# Altium project streetbot_motor_controller_module.PrjPcb
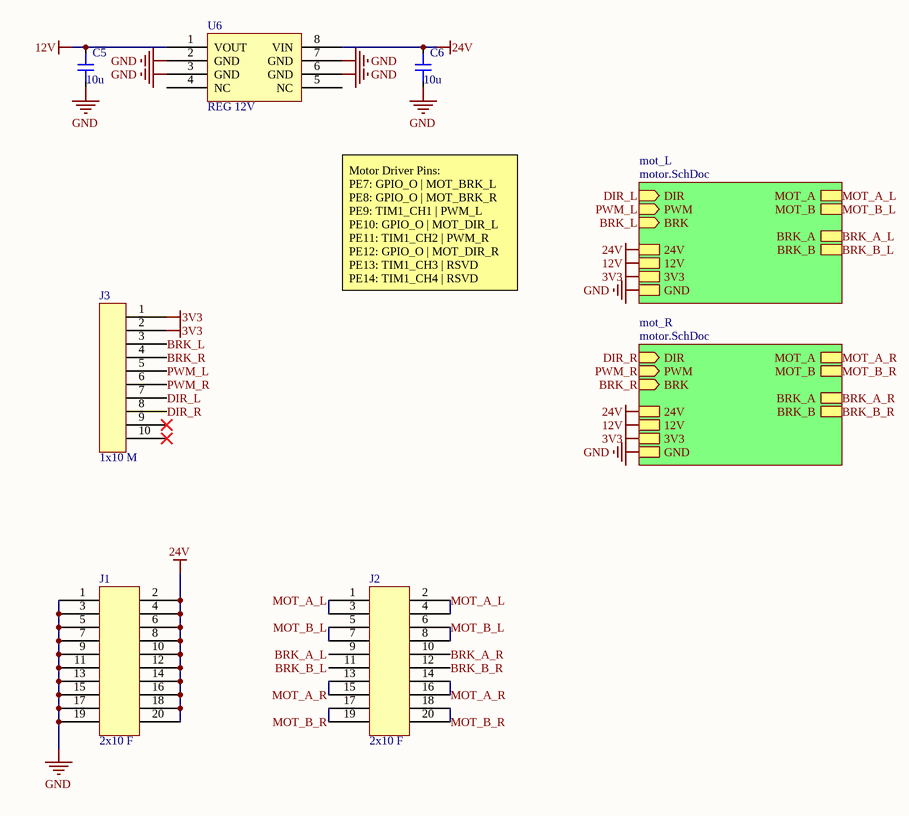
[diagram p0: main.SchDoc]
3 sheets, 60 parts. Net scope: strictly hierarchical (ports join the sheet entries above them; power ports are local).
Board file: main.PcbDoc
Sheets:
  main.SchDoc
    mot_L = motor.SchDoc
      hb1 = halfBridge.SchDoc
      hb2 = halfBridge.SchDoc
    mot_R = motor.SchDoc
      hb1 = halfBridge.SchDoc
      hb2 = halfBridge.SchDoc

## Sheet main.SchDoc
size A

### Parts
C5  10u  [CAP 0805 L]
C6  10u  [CAP 0805 L]
J1  2x10 F  [CONN HDR 2x10 F BOT]
J2  2x10 F  [CONN HDR 2x10 F BOT]
J3  1x10 M  [CONN HDR 1x10 M]
U6  REG 12V  [SOIC-8]

### Sub-sheets
mot_L = motor.SchDoc: DIR (in), PWM (in), 3V3, GND, MOT_A, MOT_B, BRK_A, BRK_B, BRK (in), 12V, 24V
mot_R = motor.SchDoc: DIR (in), PWM (in), 3V3, GND, MOT_A, MOT_B, BRK_A, BRK_B, BRK (in), 12V, 24V

### Nets
3V3: J3.1 J3.2 ; sheet mot_L/3V3, sheet mot_R/3V3
12V: C5.2 U6.1(VOUT) ; sheet mot_L/12V, sheet mot_R/12V
24V: C6.2 J1.2 J1.4 J1.6 J1.8 J1.10 J1.12 J1.14 J1.16 J1.18 J1.20 J2.9 J2.10 U6.8(VIN) ; sheet mot_L/BRK_A, sheet mot_L/24V, sheet mot_R/BRK_A, sheet mot_R/24V  [also labelled BRK_A_L, BRK_A_R]
GND: C5.1 C6.1 J1.1 J1.3 J1.5 J1.7 J1.9 J1.11 J1.13 J1.15 J1.17 J1.19 U6.2(GND) U6.3(GND) U6.6(GND) U6.7(GND) ; sheet mot_L/GND, sheet mot_R/GND
BRK_B_L: J2.11 ; sheet mot_L/BRK_B
BRK_B_R: J2.12 ; sheet mot_R/BRK_B
BRK_L: J3.3 ; sheet mot_L/BRK
BRK_R: J3.4 ; sheet mot_R/BRK
DIR_L: J3.7 ; sheet mot_L/DIR
DIR_R: J3.8 ; sheet mot_R/DIR
MOT_A_L: J2.1 J2.2 J2.3 J2.4 ; sheet mot_L/MOT_A
MOT_A_R: J2.13 J2.14 J2.15 J2.16 ; sheet mot_R/MOT_A
MOT_B_L: J2.5 J2.6 J2.7 J2.8 ; sheet mot_L/MOT_B
MOT_B_R: J2.17 J2.18 J2.19 J2.20 ; sheet mot_R/MOT_B
PWM_L: J3.5 ; sheet mot_L/PWM
PWM_R: J3.6 ; sheet mot_R/PWM

Not connected (* = marked no-connect by the designer): J3 9* 10*; U6 4(NC) 5(NC)

### Notes on the sheet
- Motor Driver Pins:
  PE7: GPIO_O | MOT_BRK_L
  PE8: GPIO_O | MOT_BRK_R
  PE9: TIM1_CH1 | PWM_L
  PE10: GPIO_O | MOT_DIR_L
  PE11: TIM1_CH2 | PWM_R
  PE12: GPIO_O | MOT_DIR_R
  PE13: TIM1_CH3 | RSVD
  PE14: TIM1_CH4 | RSVD

### Library data of the parts
C5 C6 = CAP 0805
J1 J2 = CONN Header 2x10 F: SFH11-PBPC-D10-ST-BK; Supplier 1: Digi-Key; Supplier Part Number 1: S9197-ND
J3 = CONN header 1x10 M
U6 = IC REG 12V LINEAR: L78L12ABD-TR; Supplier 1: Digi-Key; Supplier Part Number 1: 497-7767-1-ND

## Sheet motor.SchDoc
size A
Used 2 times, as channels mot_L, mot_R. Parts and nets are listed once, with the designators drawn on the sheet.
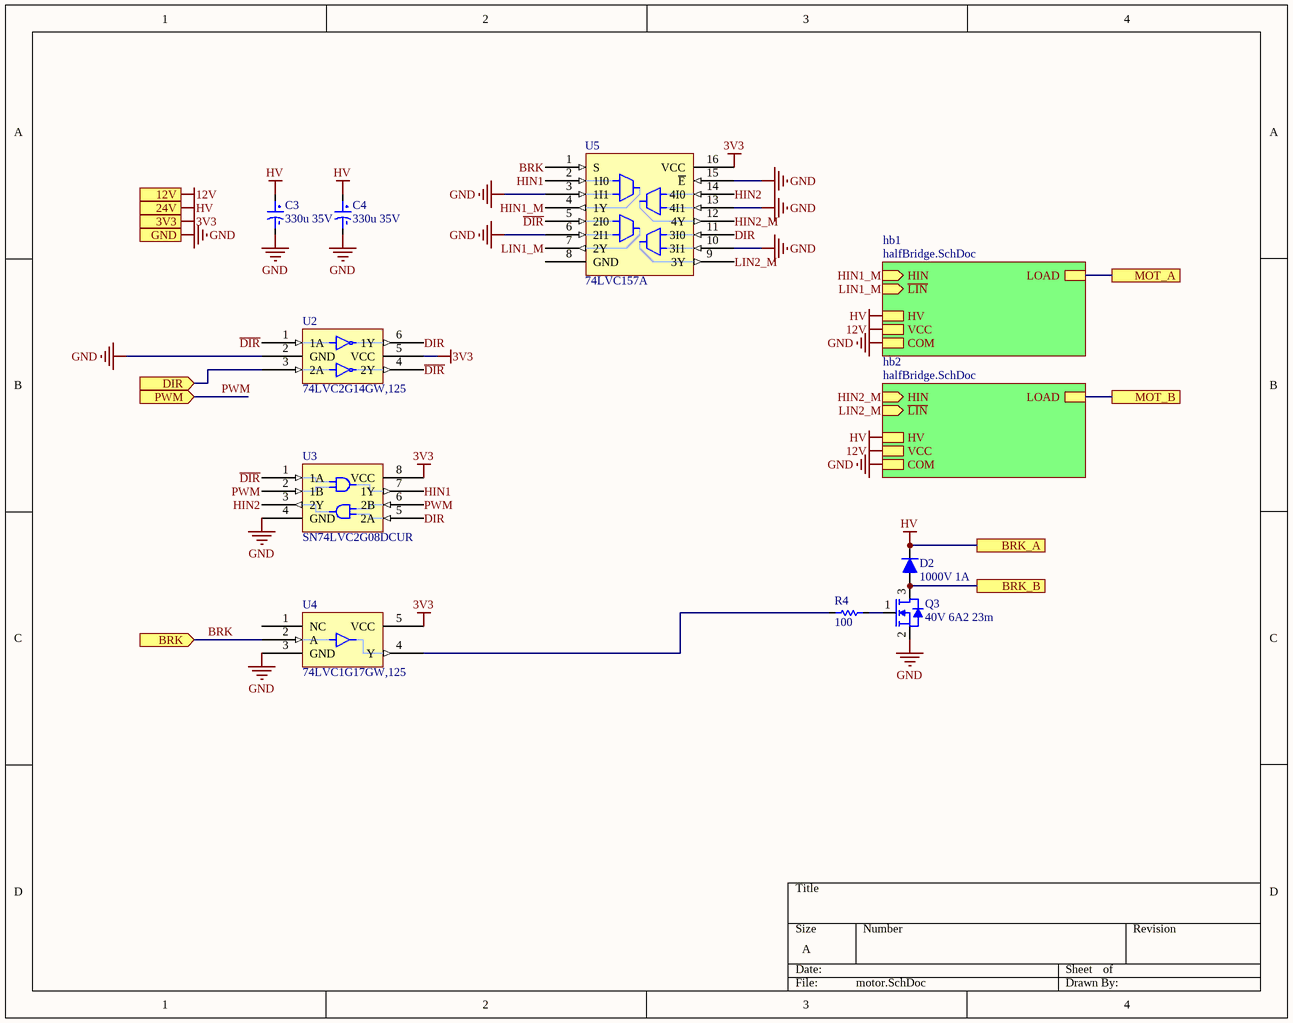
[diagram p1: motor.SchDoc]

### Parts
C3  330u 35V  [CAP ALUM 10X10]
C4  330u 35V  [CAP ALUM 10X10]
D2  1000V 1A  [DIOM4426X30M]
Q3  40V 6A2 23m  [SOT457_FET]
R4  100  [RES 0603 L]
U2  74LVC2G14GW,125  [SOT363]
U3  SN74LVC2G08DCUR  [VSSOP-8]
U4  74LVC1G17GW,125  [SOT753]
U5  74LVC157A  [TSSOP-16]

### Sub-sheets
hb1 = halfBridge.SchDoc: HIN (in), ~{LIN} (in), LOAD, COM, HV, VCC
hb2 = halfBridge.SchDoc: HIN (in), ~{LIN} (in), LOAD, COM, HV, VCC

### Ports
3V3, 12V, 24V, BRK (in), BRK_A, BRK_B, DIR (in), GND, MOT_A, MOT_B, PWM (in)

### Nets
3V3: U2.5(VCC) U3.8(VCC) U4.5(VCC) U5.16(VCC) ; port 3V3
12V: port 12V, sheet hb1/VCC, sheet hb2/VCC
GND: C3.2 C4.2 Q3.2 U2.2(GND) U3.4(GND) U4.3(GND) U5.3(1I1) U5.6(2I1) U5.10(3I1) U5.13(4I1) U5.15(~{E}) ; port GND, sheet hb1/COM, sheet hb2/COM
HV: C3.1 C4.1 D2.2 ; port 24V, port BRK_A, sheet hb1/HV, sheet hb2/HV
BRK: U4.2(A) U5.1(S) ; port BRK
BRK_B: D2.1 Q3.3 ; port BRK_B
~{DIR}: U2.1(1A) U2.4(2Y) U3.1(1A) U5.5(2I0)
DIR: U2.6(1Y) U3.5(2A) U5.11(3I0)
DIR: U2.3(2A) ; port DIR  [a separate net that carries the same name]
HIN1: U3.7(1Y) U5.2(1I0)
HIN1_M: U5.4(1Y) ; sheet hb1/HIN
HIN2: U3.3(2Y) U5.14(4I0)
HIN2_M: U5.12(4Y) ; sheet hb2/HIN
LIN1_M: U5.7(2Y) ; sheet hb1/~{LIN}
LIN2_M: U5.9(3Y) ; sheet hb2/~{LIN}
MOT_A: port MOT_A, sheet hb1/LOAD
MOT_B: port MOT_B, sheet hb2/LOAD
PWM: U3.2(1B) U3.6(2B) ; port PWM
NetQ3_1: Q3.1 R4.2
NetR4_1: R4.1 U4.4(Y)

Not connected (* = marked no-connect by the designer): U4 1(NC); U5 8(GND)

### Channels
mot_L: designators end in _1; ports 3V3=3V3 12V=12V 24V=24V BRK=BRK_L BRK_A=24V BRK_B=BRK_B_L DIR=DIR_L GND=GND MOT_A=MOT_A_L MOT_B=MOT_B_L PWM=PWM_L
mot_R: designators end in _2; ports 3V3=3V3 12V=12V 24V=24V BRK=BRK_R BRK_A=24V BRK_B=BRK_B_R DIR=DIR_R GND=GND MOT_A=MOT_A_R MOT_B=MOT_B_R PWM=PWM_R

### Library data of the parts
C3 C4 = CAP 330uF 35V: PANASONIC ELECTRONIC COMPONENTS         EEE1VA331P             SMD Aluminium Electrolytic Capacitor, Radial Can - SMD, 330 F, 35 V, S Series; Manufacturer Part Number 1: EEE-1VA331P; Polarity: Polar; Life (Hours): 2000Hour; Leakage Current: 3uA; Capacitance: 330uF; Ripple Current (AC): 350mA; Tolerance: 20%; Supplier 1: Digi-Key; Supplier Part Number 1: PCE3959CT-ND; Manufacturer 1: Panasonic; RoHS: Yes; Category: Aluminum Electrolytic Capacitors; Stock 1: 45237; Pricing 1: 1=0.73000, 10=0.51400, 50=0.38880, 100=0.33860 (USD); Mount: Surface Mount,PCB; Case/Package: Radial; Contact Plating: Tin; Min Operating Temperature: -40°C; Max Operating Temperature: 85°C; Termination: SMD/SMT; Voltage: 35V; Voltage Rating: 35V; Packaging: Tape and Reel; Ripple Current: 350mA; Voltage Rating (DC): 35V; Package Quantity: 500; Diameter: 10mm; Length: 10.5mm; Height: 10.2mm; Height - Seated (Max): 0.402inch; Radiation Hardening: No; Lead Free: Lead Free; REACH SVHC: No SVHC; ComponentLink1URL: https://datasheet.ciiva.com/16389/aba0000ce2-16389541.pdf?src-supplier=Future+Electronics; ComponentLink1Description: https://datasheet.ciiva.com/16389/aba0000ce2-16389541.pdf?src-supplier=Future+Electronics; ComponentLink2URL: https://datasheet.ciiva.com/30235/11aba0000ce2-30235093.pdf?src-supplier=Onlinecomponents.com; ComponentLink2Description: https://datasheet.ciiva.com/30235/11aba0000ce2-30235093.pdf?src-supplier=Onlinecomponents.com; ComponentLink3URL: https://datasheet.ciiva.com/46374/aba0000ce2-46374421.pdf?src-supplier=Element14; ComponentLink3Description: https://datasheet.ciiva.com/46374/aba0000ce2-46374421.pdf?src-supplier=Element14; ComponentLink4URL: https://datasheet.ciiva.com/43470/aba0000ce2-43470694.pdf?src-supplier=Farnell; ComponentLink4Description: https://datasheet.ciiva.com/43470/aba0000ce2-43470694.pdf?src-supplier=Farnell; ComponentLink5URL: https://datasheet.ciiva.com/14593/70255710-14593929.pdf?src-supplier=Allied+Electronics; ComponentLink5Description: https://datasheet.ciiva.com/14593/70255710-14593929.pdf?src-supplier=Allied+Electronics; ComponentLink6URL: https://datasheet.ciiva.com/24025/aba0000ce2-40801-24025561.pdf?src-supplier=Mouser; ComponentLink6Description: https://datasheet.ciiva.com/24025/aba0000ce2-40801-24025561.pdf?src-supplier=Mouser; ComponentLink7URL: https://datasheet.ciiva.com/14599/70255710-14599770.pdf?src-supplier=Allied+Electronics; ComponentLink7Description: https://datasheet.ciiva.com/14599/70255710-14599770.pdf?src-supplier=Allied+Electronics; ComponentLink8URL: https://datasheet.ciiva.com/17534/aba0000ce2-17534540.pdf?src-supplier=Avnet+Europe; ComponentLink8Description: https://datasheet.ciiva.com/17534/aba0000ce2-17534540.pdf?src-supplier=Avnet+Europe; ComponentLink9URL: https://datasheet.ciiva.com/31414/aba0000ce2-31414702.pdf?src-supplier=Farnell; ComponentLink9Description: https://datasheet.ciiva.com/31414/aba0000ce2-31414702.pdf?src-supplier=Farnell
D2 = DIODE 1000V 1A: S1MTR
Q3 = FET 40V 6A2 23mR: PMN20ENAX
R4 = RES 0603
U2 = IC NOT 2CH
U3 = IC AND2 2CH
U4 = IC BUF 1CH
U5 = IC MUX 4CH 2:1: 74LVC157APW; Supplier 1: Digi-Key; Supplier Part Number 1: 1727-4028-1-ND

## Sheet halfBridge.SchDoc
size A
Used 4 times, as channels mot_L/hb1, mot_L/hb2, mot_R/hb1, mot_R/hb2. Parts and nets are listed once, with the designators drawn on the sheet.
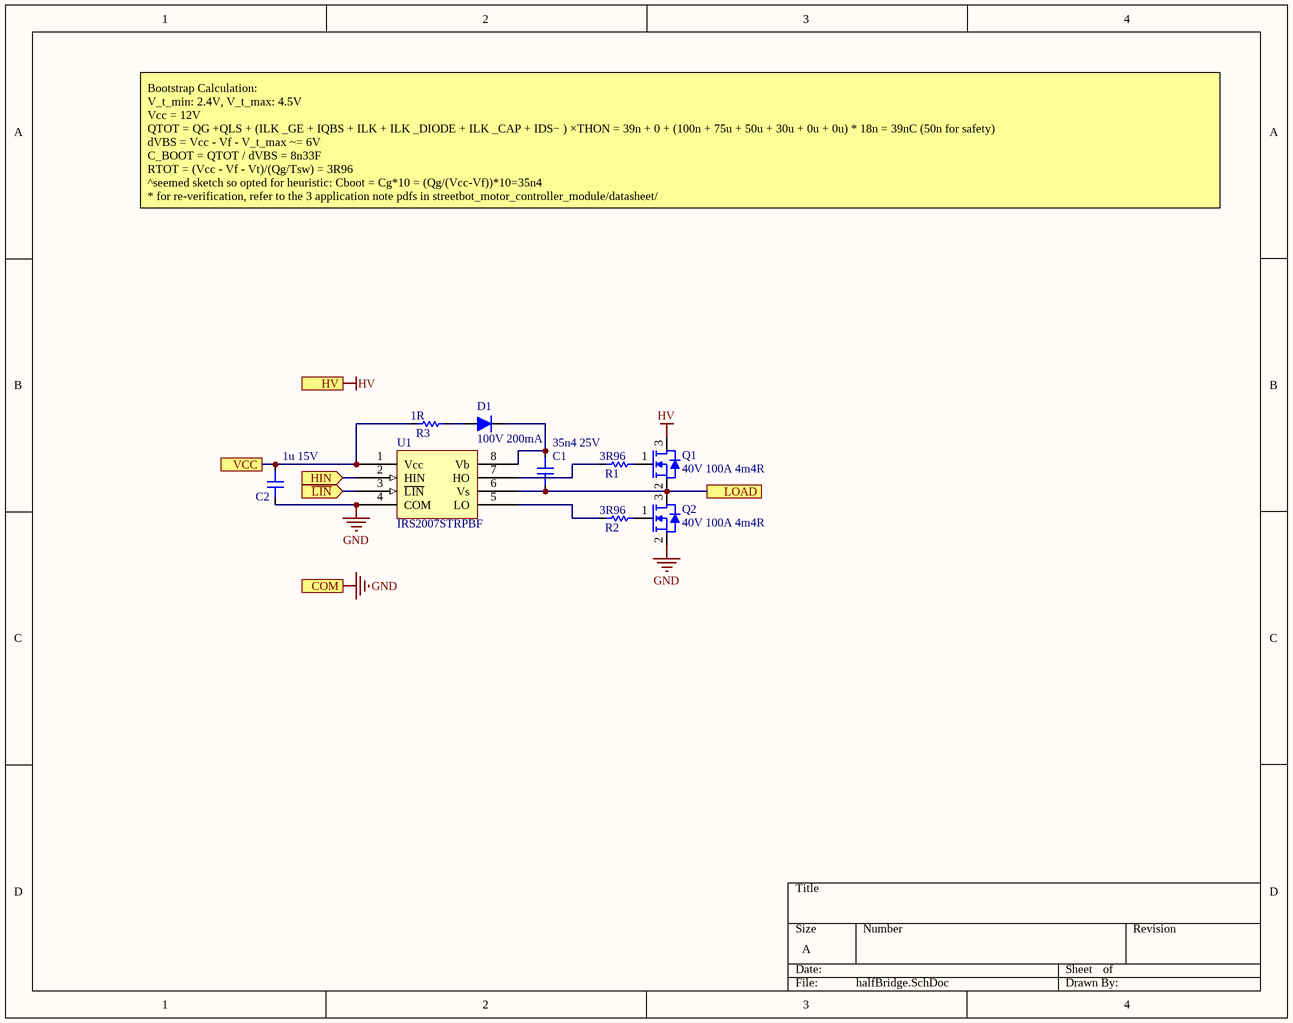
[diagram p2: halfBridge.SchDoc]

### Parts
C1  35n4 25V  [CAP 0805 L]
C2  1u 15V  [CAP 0805 L]
D1  100V 200mA  [SODFL250X100-2M]
Q1  40V 100A 4m4R  [DPAK127P600X120-5M (LFPAK56; Power-SO8)]
Q2  40V 100A 4m4R  [DPAK127P600X120-5M (LFPAK56; Power-SO8)]
R1  3R96  [RES 0603 L]
R2  3R96  [RES 0603 L]
R3  1R  [RES 0603 L]
U1  IRS2007STRPBF  [SOIC-8]

### Ports
COM, HIN (in), HV, LOAD, VCC, ~{LIN} (in)

### Nets
GND: C2.1 Q2.2 U1.4(COM) ; port COM
HV: Q1.3 ; port HV
HIN: U1.2(HIN) ; port HIN
~{LIN}: U1.3(~{LIN}) ; port ~{LIN}
LOAD: C1.1 Q1.2 Q2.3 U1.6(Vs) ; port LOAD
VCC: C2.2 R3.1 U1.1(Vcc) ; port VCC
NetC1_2: C1.2 D1.2 U1.8(Vb)
NetD1_1: D1.1 R3.2
NetQ1_1: Q1.1 R1.2
NetQ2_1: Q2.1 R2.2
NetR1_1: R1.1 U1.7(HO)
NetR2_1: R2.1 U1.5(LO)

### Channels
mot_L/hb1: designators end in _1; ports COM=GND HIN=HIN1_M_mot_L HV=24V LOAD=MOT_A_L VCC=12V ~{LIN}=LIN1_M_mot_L
mot_L/hb2: designators end in _2; ports COM=GND HIN=HIN2_M_mot_L HV=24V LOAD=MOT_B_L VCC=12V ~{LIN}=LIN2_M_mot_L
mot_R/hb1: designators end in _3; ports COM=GND HIN=HIN1_M_mot_R HV=24V LOAD=MOT_A_R VCC=12V ~{LIN}=LIN1_M_mot_R
mot_R/hb2: designators end in _4; ports COM=GND HIN=HIN2_M_mot_R HV=24V LOAD=MOT_B_R VCC=12V ~{LIN}=LIN2_M_mot_R

### Notes on the sheet
- Bootstrap Calculation:
  V_t_min: 2.4V, V_t_max: 4.5V
  Vcc = 12V
  QTOT = QG +QLS + (ILK _GE + IQBS + ILK + ILK _DIODE + ILK _CAP + IDS− ) ×THON = 39n + 0 + (100n + 75u + 50u + 30u + 0u + 0u) * 18n = 39nC (50n for safety)
  dVBS = Vcc - Vf - V_t_max ~= 6V
  C_BOOT = QTOT / dVBS = 8n33F
  RTOT = (Vcc - Vf - Vt)/(Qg/Tsw) = 3R96
  ^seemed sketch so opted for heuristic: Cboot = Cg*10 = (Qg/(Vcc-Vf))*10=35n4
  * for re-verification, refer to the 3 application note pdfs in streetbot_motor_controller_module/datasheet/

### Library data of the parts
C1 C2 = CAP 0805
D1 = DIODE 100V 200mA: BAS16GWJ
Q1 Q2 = FET 40V 100A 4m4R: BUK7Y4R4-40EX
R1-R3 = RES 0603: 0603 RES
U1 = IC Half Bridge Driver

## Nets that join several sheets
3V3: main (J3.1 J3.2), mot_L (U2_1.5 U3_1.8 U4_1.5 U5_1.16), mot_R (U2_2.5 U3_2.8 U4_2.5 U5_2.16)
12V: main (C5.2 U6.1), mot_L/hb1 (C2_1.2 R3_1.1 U1_1.1), mot_L/hb2 (C2_2.2 R3_2.1 U1_2.1), mot_R/hb1 (C2_3.2 R3_3.1 U1_3.1), mot_R/hb2 (C2_4.2 R3_4.1 U1_4.1)
24V: main (14 pins), mot_L (C3_1.1 C4_1.1 D2_1.2), mot_L/hb1 (Q1_1.3), mot_L/hb2 (Q1_2.3), mot_R (C3_2.1 C4_2.1 D2_2.2), mot_R/hb1 (Q1_3.3), mot_R/hb2 (Q1_4.3)
GND: main (16 pins), mot_L (11 pins), mot_L/hb1 (C2_1.1 Q2_1.2 U1_1.4), mot_L/hb2 (C2_2.1 Q2_2.2 U1_2.4), mot_R (11 pins), mot_R/hb1 (C2_3.1 Q2_3.2 U1_3.4), mot_R/hb2 (C2_4.1 Q2_4.2 U1_4.4)
BRK_B_L: main (J2.11), mot_L (D2_1.1 Q3_1.3)
BRK_B_R: main (J2.12), mot_R (D2_2.1 Q3_2.3)
BRK_L: main (J3.3), mot_L (U4_1.2 U5_1.1)
BRK_R: main (J3.4), mot_R (U4_2.2 U5_2.1)
DIR_L: main (J3.7), mot_L (U2_1.3)
DIR_R: main (J3.8), mot_R (U2_2.3)
HIN1_M_mot_L: mot_L (U5_1.4), mot_L/hb1 (U1_1.2)
HIN1_M_mot_R: mot_R (U5_2.4), mot_R/hb1 (U1_3.2)
HIN2_M_mot_L: mot_L (U5_1.12), mot_L/hb2 (U1_2.2)
HIN2_M_mot_R: mot_R (U5_2.12), mot_R/hb2 (U1_4.2)
LIN1_M_mot_L: mot_L (U5_1.7), mot_L/hb1 (U1_1.3)
LIN1_M_mot_R: mot_R (U5_2.7), mot_R/hb1 (U1_3.3)
LIN2_M_mot_L: mot_L (U5_1.9), mot_L/hb2 (U1_2.3)
LIN2_M_mot_R: mot_R (U5_2.9), mot_R/hb2 (U1_4.3)
MOT_A_L: main (J2.1 J2.2 J2.3 J2.4), mot_L/hb1 (C1_1.1 Q1_1.2 Q2_1.3 U1_1.6)
MOT_A_R: main (J2.13 J2.14 J2.15 J2.16), mot_R/hb1 (C1_3.1 Q1_3.2 Q2_3.3 U1_3.6)
MOT_B_L: main (J2.5 J2.6 J2.7 J2.8), mot_L/hb2 (C1_2.1 Q1_2.2 Q2_2.3 U1_2.6)
MOT_B_R: main (J2.17 J2.18 J2.19 J2.20), mot_R/hb2 (C1_4.1 Q1_4.2 Q2_4.3 U1_4.6)
PWM_L: main (J3.5), mot_L (U3_1.2 U3_1.6)
PWM_R: main (J3.6), mot_R (U3_2.2 U3_2.6)